# EAGLE design BottleBuddy-V1.1 (EAGLE 7.4.0)
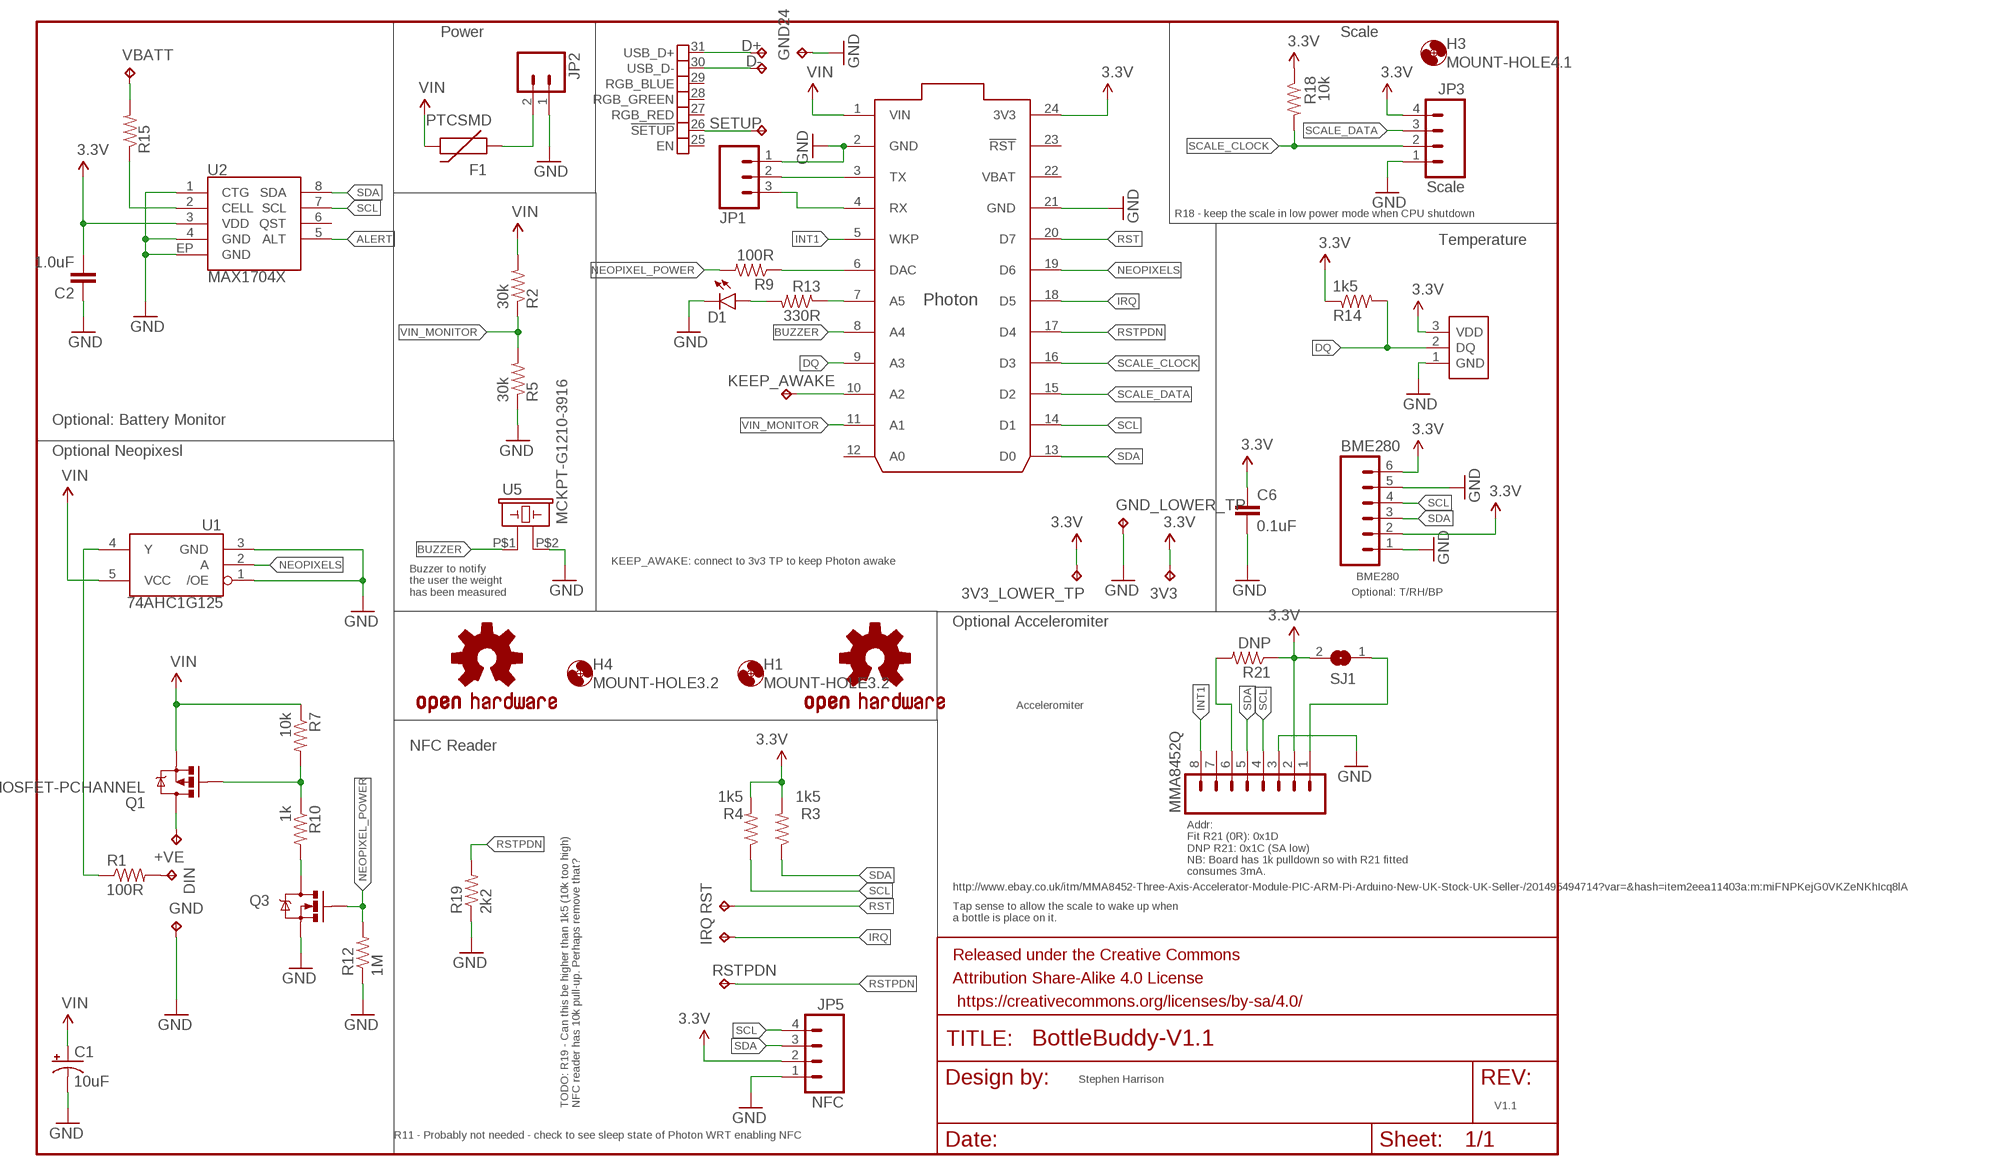
[diagram p0: schematic, sheet 1]

## Parts
3V3  TPTP20R  [TP20R]
3V3_LOWER_TP  TPTP20R  [TP20R]
+VE  TPTP20R  [TP20R]
BME280  M06SILK_FEMALE_PTH  [1X06]
C1  10uF  10UF-16V-10%(TANT)  [EIA3216]
C2  1.0uF  1.0UF-25V-+80/-20(0805)"  [0805-CAP]
C6  0.1uF  CAP0805  [0805]
D1  LED1206-BOTTOM  [LED-1206-BOTTOM]
D+  TPTP20R  [TP20R]
D-  TPTP20R  [TP20R]
DIN  TPTP20R  [TP20R]
F1  PTCSMD  [PTC-1206]
FRAME1  FRAME-LETTER  [CREATIVE_COMMONS]
GND  TPTP20R  [TP20R]
GND24  TPTP20R  [TP20R]
GND_LOWER_TP  TPTP20R  [TP20R]
H1  MOUNT-HOLE3.2  [3,2]
H3  MOUNT-HOLE4.1  [4,1]
H4  MOUNT-HOLE3.2  [3,2]
IRQ  NFC IRQ  TPTP20R  [TP20R]
JP1  M03PTH  [1X03]
JP2  M02-JST-2MM-SMT  [JST-2-SMD]
JP3  Scale  M04PTH  [1X04]
JP5  NFC  M04PTH  [1X04]
KEEP_AWAKE  TPTP20R  [TP20R]
LOGO1  OSHW-LOGOL  [OSHW-LOGO-L]
LOGO2  OSHW-LOGOL  [OSHW-LOGO-L]
MMA8452Q  M08SILK_FEMALE_PTH  [1X08]
Q1  MOSFET-PCHANNEL  [SOT23-3]
Q3  200mA/50V  MOSFET-NCHANNELBSS138  [SOT23-3]
R1  100R  RESISTOR1206  [1206]
R2  30k  RESISTOR1206  [1206]
R3  1k5  RESISTOR1206  [1206]
R4  1k5  RESISTOR1206  [1206]
R5  30k  RESISTOR1206  [1206]
R7  10k  RESISTOR1206  [1206]
R9  100R  RESISTOR1206  [1206]
R10  1k  RESISTOR1206  [1206]
R12  1M  RESISTOR1206  [1206]
R13  330R  RESISTOR1206  [1206]
R14  1k5  RESISTOR1206  [1206]
R15  RESISTOR1206  [1206]
R18  10k  RESISTOR1206  [1206]
R19  2k2  RESISTOR1206  [1206]
R21  DNP  RESISTOR1206  [1206]
RST  TPTP20R  [TP20R]
RSTPDN  NFC IRQ  TPTP20R  [TP20R]
S1  SENSOR-DS18B20  [TO-92-TRIANGLE]
SETUP  TPTP20R  [TP20R]
SJ1  SJ  [SJ]
U1  74AHC1G125  [SOT23-5]
U2  MAX1704X  [TDFN-8]
U5  MCKPT-G1210-3916  [BUZZER-12MM]
U$1  PHOTON_SMD  [PHOTON_SMD]
VBATT  TPTP20R  [TP20R]

## Nets
3.3V: 3V3.TP 3V3_LOWER_TP.TP BME280.2 BME280.6 C2.2 C6.1 JP3.4 JP5.2 MMA8452Q.2 R3.2 R4.2 R14.1 R18.1 R21.1 S1.3(VDD) SJ1.2 U2.3(VDD) U$1.24(3V3)
ALERT: U2.5(ALT)
BUZZER: U5.P$1 U$1.8(A4)
DQ: R14.2 S1.2(DQ) U$1.9(A3)
GND: BME280.1 BME280.5 C1.C(-) C2.1 C6.2 D1.C GND24.TP GND.TP GND_LOWER_TP.TP JP1.1 JP2.1 JP3.1 JP5.1 MMA8452Q.3 Q3.2(S) R5.1 R12.1 R19.1 S1.1(GND) U1.1(/OE) U1.3(GND) U2.1(CTG) U2.4(GND) U2.EP(GND) U5.P$2 U$1.2(GND) U$1.21(GND)
INT1: MMA8452Q.8 U$1.5(WKP)
IRQ: IRQ.TP U$1.18(D5)
N$1: Q1.1(G) R7.2 R10.1
N$2: F1.1 JP2.2
N$3: Q3.3(D) R10.2
N$4: JP1.3 U$1.4(RX)
N$5: R9.1 U$1.6(DAC)
N$6: +VE.TP Q1.3(D)
N$7: JP1.2 U$1.3(TX)
N$9: D1.A R13.2
N$10: R13.1 U$1.7(A5)
N$11: R15.2 VBATT.TP
N$12: KEEP_AWAKE.TP U$1.10(A2)
N$14: DIN.TP R1.2
N$15: R15.1 U2.2(CELL)
N$16: R1.1 U1.4(Y)
N$17: D+.TP U$1.31(USB_D+)
N$18: MMA8452Q.1 SJ1.1
N$19: D-.TP U$1.30(USB_D-)
N$20: MMA8452Q.6 R21.2
NEOPIXEL_POWER: Q3.1(G) R9.2 R12.2
NEOPIXELS: U1.2(A) U$1.19(D6)
RST: RST.TP U$1.20(D7)
RSTPDN: R19.2 RSTPDN.TP U$1.17(D4)
SCALE_CLOCK: JP3.2 R18.2 U$1.16(D3)
SCALE_DATA: JP3.3 U$1.15(D2)
SCL: BME280.4 JP5.4 MMA8452Q.4 R4.1 U2.7(SCL) U$1.14(D1)
SDA: BME280.3 JP5.3 MMA8452Q.5 R3.1 U2.8(SDA) U$1.13(D0)
SETUP: SETUP.TP U$1.26(!SETUP)
VIN: C1.A(+) F1.2 Q1.2(S) R2.2 R7.1 U1.5(VCC) U$1.1(VIN)
VIN_MONITOR: R2.1 R5.2 U$1.11(A1)
Unconnected: MMA8452Q.7 U2.6(QST) U$1.12(A0) U$1.23(!RST) U$1.25(EN) U$1.27(RGB_RED) U$1.28(RGB_GREEN) U$1.29(RGB_BLUE)

## Notes on the sheet
- Power | Scale
- R18 - keep the scale in low power mode when CPU shutdown
- Temperature
- Optional: Battery Monitor
- Optional Neopixesl
- KEEP_AWAKE: connect to 3v3 TP to keep Photon awake
- BME280
- Buzzer to notify
  the user the weight
  has been measured
- Optional: T/RH/BP
- Optional Acceleromiter
- Acceleromiter
- NFC Reader
- Addr: 
  Fit R21 (0R): 0x1D
  DNP R21: 0x1C (SA low)
  NB: Board has 1k pulldown so with R21 fitted
  consumes 3mA.
- http://www.ebay.co.uk/itm/MMA8452-Three-Axis-Accelerator-Module-PIC-ARM-Pi-Arduino-New-UK-Stock-UK-Seller-/201495494714?var=&hash=item2eea11403a:m:miFNPKejG0VKZeNKhIcq8lA
- Tap sense to allow the scale to wake up when
  a bottle is place on it.
- Stephen Harrison
- TODO: R19 - Can this be higher than 1k5 (10k too high)
  NFC reader has 10k pull-up. Perhaps remove that?
- V1.1
- R11 - Probably not needed - check to see sleep state of Photon WRT enabling NFC

## Power pins joined to a net without a drawn wire
VBAT: U$1.22(VBAT)

## Library data of the parts
3V3 3V3_LOWER_TP +VE D+ D- DIN GND GND24 GND_LOWER_TP IRQ KEEP_AWAKE RST RSTPDN SETUP VBATT = testpad:TP: Test pad
BME280 = SparkFun-Connectors:M06: Header 6 Standard 6-pin 0.1" header. Use with straight break away headers (SKU : PRT-00116), right angle break away headers (PRT-00553), swiss pins (PRT-00743), machine pins (PRT-00117), and female headers (PRT-00115). Molex polarized connector foot print use with SKU : PRT-08094 with associated crimp pins and housings. NOTES ON THE VARIANTS LOCK and LOCK_LONGPADS... This footprint was designed to help hold the alignment of a through-hole component (i.e. 6-pin header) while soldering it into place. You may notice that each hole has been shifted either up or down by 0.005 of an inch from it's more standard position (which is a perfectly straight line). This slight alteration caused the pins (the squares in the middle) to touch the edges of the holes. Because they are alternating, it causes a "brace" to hold the component in place. 0.005 has proven to be the perfect amount of "off-center" position when using our standard breakaway headers. Although looks a little odd when you look at the bare footprint, once you have a header in there, the alteration is very hard to notice. Also,if you push a header all the way into place, it is covered up entirely on the bottom side. This idea of altering the position of holes to aid alignment will be further integrated into the Sparkfun Library for other footprints. It can help hold any component with 3 or more connection pins.; PROD_ID: CONN-08437
C1 = SparkFun-Capacitors:10UF-16V-10%(TANT): CAP-00811 1206/EIA-3216 Tantalum capacitor; PROD_ID: CAP-00811
C2 = SparkFun-Capacitors:1.0UF-25V-+80/-20(0805): CAP-11625; PROD_ID: CAP-11625
C6 = SparkFun-Capacitors:CAP: Capacitor Standard 0603 ceramic capacitor, and 0.1" leaded capacitor.
D1 = SparkFun-LED:LED: LEDs Standard schematic elements and footprints for 5mm, 3mm, 1206, and 0603 sized LEDs. 5mm - Spark Fun Electronics SKU : COM-00529 (and others)
F1 = SparkFun-PowerIC:PTC: Resettable Fuse PTC Resettable Fuse. Spark Fun Electronics SKU : COM-08357; PROD_ID: RES-11150
FRAME1 = SparkFun-Aesthetics:FRAME-LETTER: Schematic Frame Standard 8.5x11 US Letter frame
H1 H3 H4 = holes:MOUNT-HOLE: MOUNTING HOLE with drill center marker
JP1 = SparkFun-Connectors:M03: Header 3 Standard 3-pin 0.1" header. Use with straight break away headers (SKU : PRT-00116), right angle break away headers (PRT-00553), swiss pins (PRT-00743), machine pins (PRT-00117), and female headers (PRT-00115). Molex polarized connector foot print use with SKU : PRT-08232 with associated crimp pins and housings.
JP2 = SparkFun-Connectors:M02: Standard 2-pin 0.1" header. Use with - straight break away headers ( PRT-00116) - right angle break away headers (PRT-00553) - swiss pins (PRT-00743) - machine pins (PRT-00117) - female headers (PRT-00115) Molex polarized connector foot print use with: PRT-08233 with associated crimp pins and housings. 2.54_SCREWTERM for use with PRT-10571. 3.5mm Screw Terminal footprints for PRT-08084 5mm Screw Terminal footprints for use with PRT-08432; PROD_ID: CONN-11443
JP3 JP5 = SparkFun-Connectors:M04: Header 4 Standard 4-pin 0.1" header. Use with straight break away headers (SKU : PRT-00116), right angle break away headers (PRT-00553), swiss pins (PRT-00743), machine pins (PRT-00117), and female headers (PRT-00115). Molex polarized connector foot print use with SKU : PRT-08231 with associated crimp pins and housings. 1MM SMD Version SKU: PRT-10208
LOGO1 LOGO2 = SparkFun-Aesthetics:OSHW-LOGO: Open Source Hardware Logo This logo indicates the piece of hardware it is found on incorporates a OSHW license and/or adheres to the definition of open source hardware found here: http://freedomdefined.org/OSHW
MMA8452Q = SparkFun-Connectors:M08: Header 8 Standard 8-pin 0.1" header. Use with straight break away headers (SKU : PRT-00116), right angle break away headers (PRT-00553), swiss pins (PRT-00743), machine pins (PRT-00117), and female headers (PRT-00115).; PROD_ID: CONN-08438
Q1 = SparkFun-DiscreteSemi:MOSFET-PCHANNEL: Generic PMOSFET IRLML2244 - TRANS-11153 (SOT-23 -20V -4.3A) (1.Gate 2.Source 3.Drain) FQP27P06 - COM-10349 <http://www.sparkfun.com/products/10349> (TO-220 -60V -27A) (1.Gate 2.Source 3.Drain); PROD_ID: TRANS-08285
Q3 = SparkFun-DiscreteSemi:MOSFET-NCHANNEL: Common NMOSFET Parts MFG P/N Store ID Prod ID FDD8780 TRANS-09984 SI7820DN TRANS-11055 FDS6630A IC-08089 2N7002PW TRANS-11151 FQP30N06L COM-10213 TRANS-10060 BSS123LT1G TRANS-08345 BSS138 TRANS-00830 BS170 2N7000; PROD_ID: TRANS-00830
R1-R5 R7 R9 R10 R12-R15 R18 R19 R21 = SparkFun-Resistors:RESISTOR: Resistor Basic schematic elements and footprints for 0603, 1206, and PTH resistors.
S1 = SENSOR-DS18B20:SENSOR-DS18B20
SJ1 = jumper:SJ: SMD solder JUMPER
U1 = SparkFun-DigitalIC:74AHC1G125: Single bus buffer gate with 3-state output; PROD_ID: IC-11920
U2 = SparkFun-PowerIC:MAX1704X: MAX17043/MAX17044: Battery Fuel Guage (43 is 1cell, 44 is 2cell); PROD-ID: IC-10399
U5 = Tinamous:MCKPT-G1210-3916
U$1 = Tinamous:PHOTON_SMD: Photon (without headers) - designed to be surface mounted with 7 extra exposed pads on the bottom of the board which include, 3 RGB LED outputs, /SETUP, EN (3.3V SMPS enable input), USB D+ and USB D-.

## Board
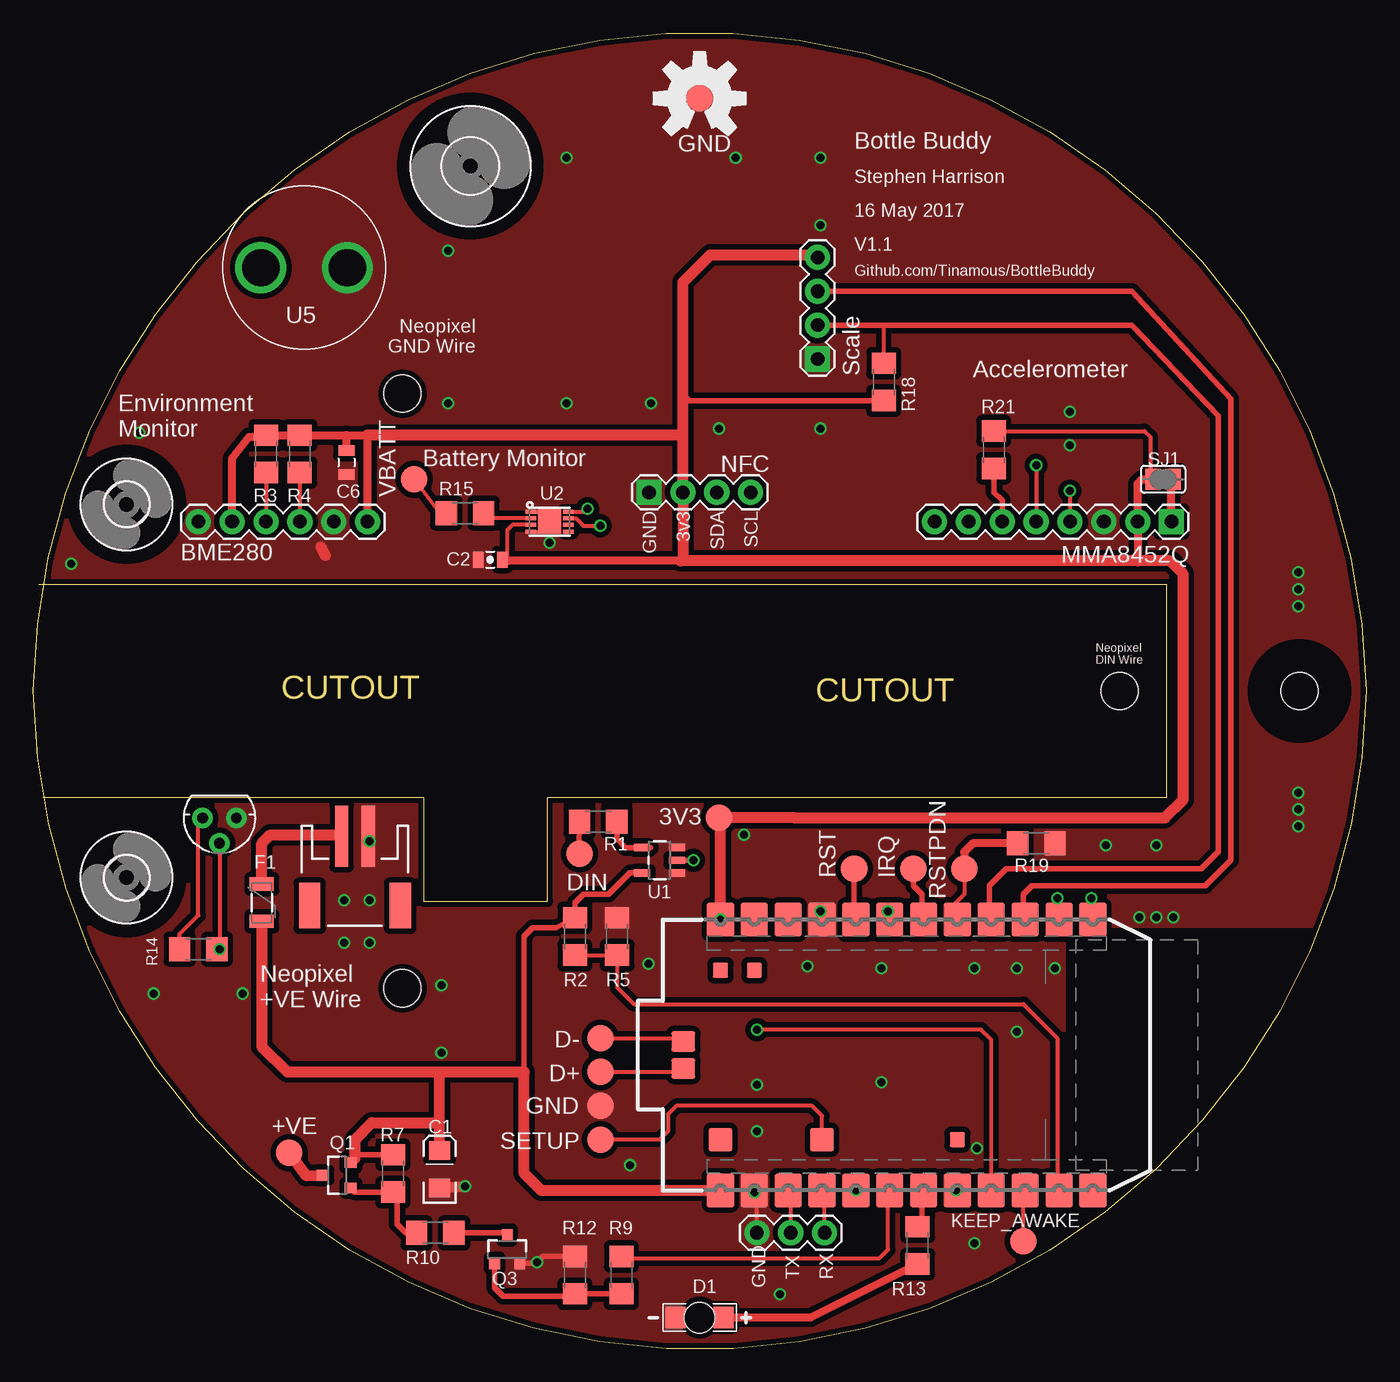
[diagram p1: board, top side]
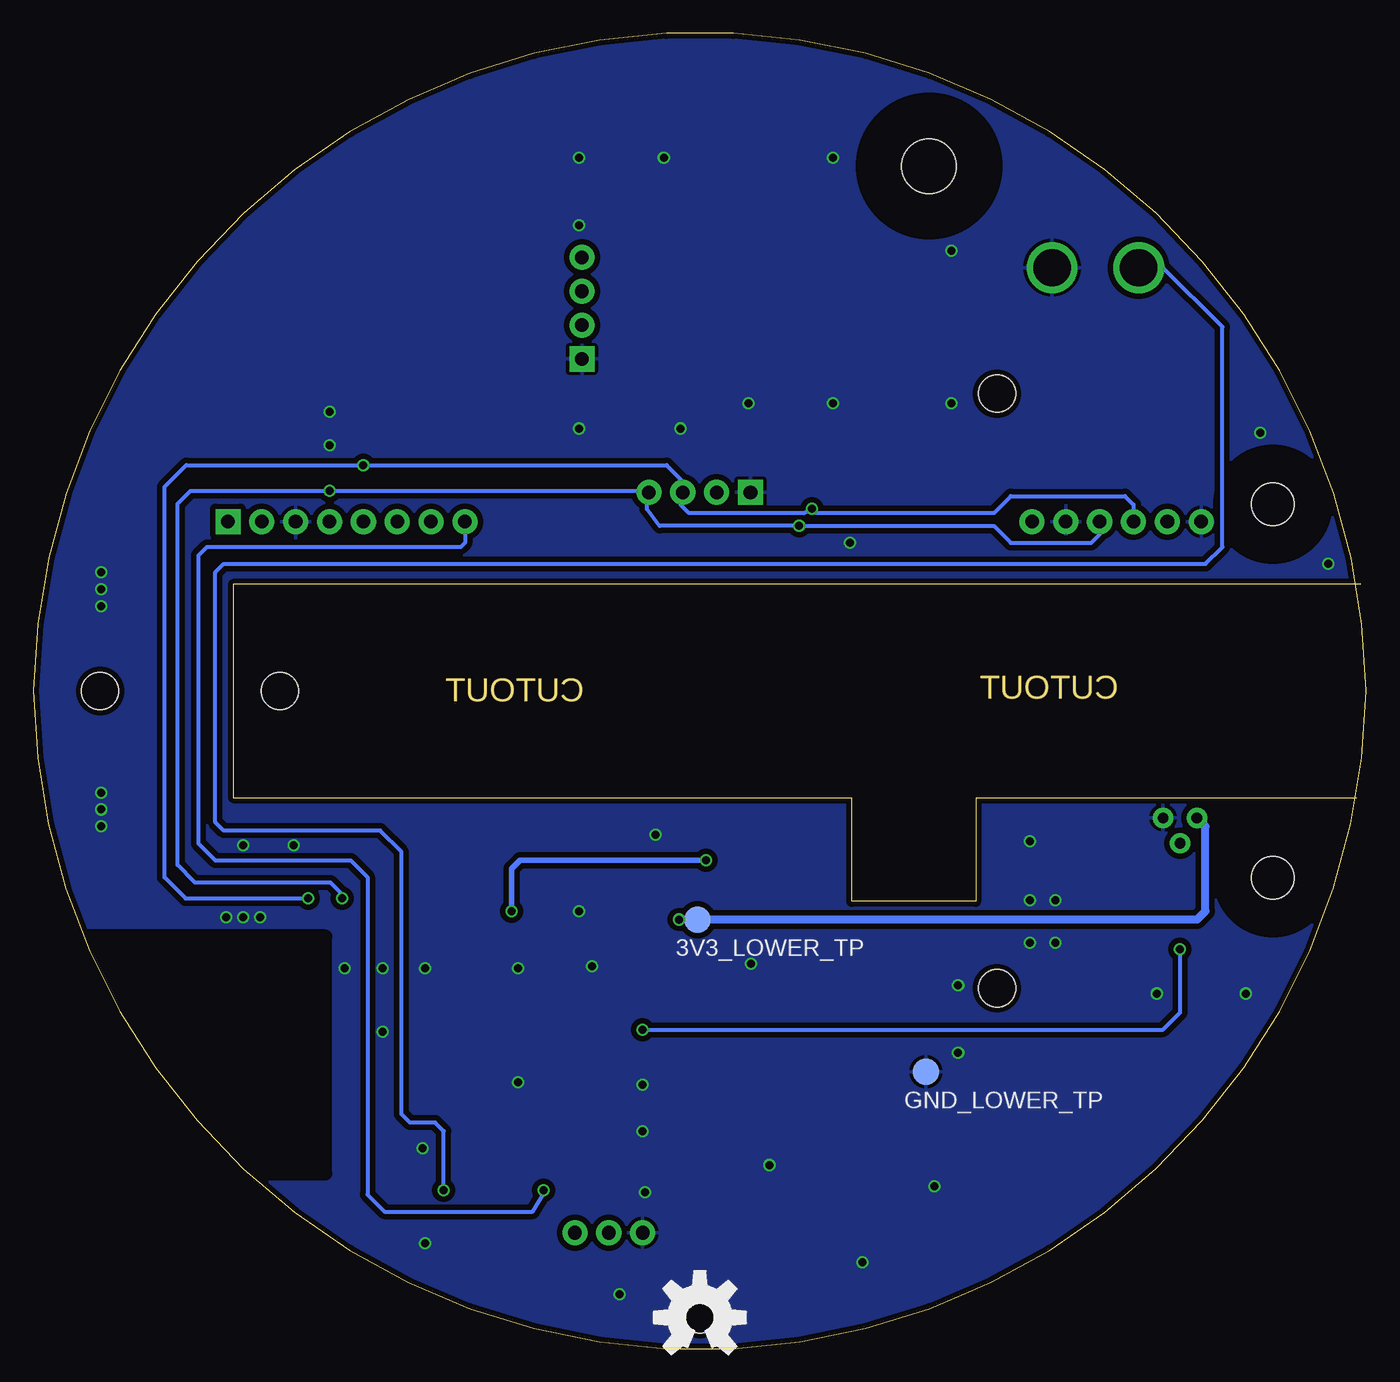
[diagram p2: board, bottom side, seen from below]

Size 100.01 x 98.66 mm. Coordinates in mm from the lower left corner, seen from the top.
Outline: 100,49.33 arc179 0,49.33 0.01,49.33 arc179 100.01,49.33
Outline: 0.4,57.33 85,57.33 85,41.33 38.6,41.33 38.6,33.55 29.3,33.55 29.3,41.33 0.7,41.33
Copper layers (1*16): Top 0.035mm / dielectric 1.5mm / Bottom 0.035mm
Design rules "dirt_cheap_dirty_boards.v1": minimum track width 5mil, minimum drill 12mil, track to track 5mil, track to pad 5mil, pad to pad 5mil, via to via 5mil, smd to smd 0mil, copper to edge 10mil, drill to drill 10mil, minimum pad ring 10mil, minimum via ring 6mil, stop-mask expansion 2mil, vias tented up to drill 25mil, thermal gap 10mil
Holes 2.8 mm at 81.5,49.33 27.7,71.63 27.7,27.03 95,49.33
tRestrict: area 78.1,13.1 to 98.4,30.9; area 91.8,46.2 to 98.2,52.5
bRestrict: area 78.1,13.1 to 98.4,30.9

### Footprints (pad centres in the part's own frame; a part is rotated, then mirrored left to right if it is on the bottom)
TP20R = smd 2 x 2: TP 0,0
1X06 = drill 1.016 pad 1.88: 1 0,0; 2 2.54,0; 3 5.08,0; 4 7.62,0; 5 10.16,0; 6 12.7,0
EIA3216 = smd 1.4 x 1.6: A 1.4,0; C -1.4,0
0805-CAP = smd 0.8 x 1.2: 1 -0.9,0; 2 0.9,0
0805 = smd 0.8 x 1.2: 1 -0.9,0; 2 0.9,0
LED-1206-BOTTOM = smd 1.5 x 1.6: A -1.8,0; C 1.8,0 | hole 2.3: 0,0
PTC-1206 = smd 1 x 1.8: 1 -1.4,0; 2 1.4,0
3,2 = hole 3.2: 0,0
4,1 = hole 4.1: 0,0
1X03 = drill 1.016 pad 1.88: 1 0,0; 2 2.54,0; 3 5.08,0
JST-2-SMD = smd 1 x 4.6: 1 -1,-3.7; 2 1,-3.7 | smd 1.6 x 3.4: NC1 -3.4,1.5; NC2 3.4,1.5
1X04 = drill 1.016 pad 1.88 square: 1 0,0 | drill 1.016 pad 1.88: 2 2.54,0; 3 5.08,0; 4 7.62,0
1X08 = drill 1.016 pad 1.88 square: 1 0,0 | drill 1.016 pad 1.88: 2 2.54,0; 3 5.08,0; 4 7.62,0; 5 10.16,0; 6 12.7,0; 7 15.24,0; 8 17.78,0
SOT23-3 = smd 0.8 x 0.9: 1 -0.95,-1; 2 0.95,-1; 3 0,1.1
1206 = smd 1.6 x 1.8: 1 -1.4,0; 2 1.4,0
TO-92-TRIANGLE = drill 0.813 pad 1.524: 1 -1.27,0; 2 0,1.905; 3 1.27,0
SJ = smd 1.168 x 1.6: 1 -0.762,0; 2 0.762,0
SOT23-5 = smd 0.55 x 1.2: 1 -0.95,-1.3; 2 0,-1.3; 3 0.95,-1.3; 4 0.95,1.3; 5 -0.95,1.3
TDFN-8 = smd 0.8 x 0.3: 1 -1.4,0.75; 2 -1.4,0.25; 3 -1.4,-0.25; 4 -1.4,-0.75; 5 1.4,-0.75; 6 1.4,-0.25; 7 1.4,0.25; 8 1.4,0.75 | smd 1.73 x 1.88: EP 0,0
BUZZER-12MM = drill 2.8: P$1 -3.25,0; P$2 3.25,0
PHOTON_SMD = smd 2.54 x 2.032: 1 0,32.258; 2 0,29.718; 3 0,27.178; 4 0,24.638; 5 0,22.098; 6 0,19.558; 7 0,17.018; 8 0,14.478; 9 0,11.938; 10 0,9.398; 11 0,6.858; 12 0,4.318; 13 20.32,4.318; 14 20.32,6.858; 15 20.32,9.398; 16 20.32,11.938; 17 20.32,14.478; 18 20.32,17.018; 19 20.32,19.558; 20 20.32,22.098; 21 20.32,24.638; 22 20.32,27.178; 23 20.32,29.718; 24 20.32,32.258 | smd 1.778 x 1.778: 25 3.81,32.258; 26 3.81,24.638 | smd 1.143 x 1.143: 27 3.81,14.478; 28 16.51,29.718; 29 16.51,32.258 | smd 1.524 x 1.778: 30 11.176,35.052; 31 9.144,35.052

### Placement (x,y rotation side)
3V3  51.44,39.8 0 top
3V3_LOWER_TP  50.16,32.18 0 bottom
+VE  19.21,14.7 0 top
BME280  12.38,62.03 0 top
C1  30.48,13.45 90 top
C2  34.29,59.17 0 top
C6  23.5,66.47 270 top
D1  50,2.33 180 top
D+  42.55,20.75 0 top
D-  42.55,23.29 0 top
DIN  41,37.1 0 top
F1  17.14,33.45 270 top
FRAME1  18.7,-10.82 0 top  (outside the outline)
GND  50,93.78 0 top
GND24  42.55,18.21 0 top
GND_LOWER_TP  33.02,20.75 0 bottom
H1  7,35.33 0 top
H3  32.8,88.7 0 top
H4  7,63.33 0 top
IRQ  66.04,35.99 0 top
JP1  54.29,8.69 0 top
JP2  24.13,34.72 180 top
JP3  58.85,74.23 90 top
JP5  46.2,64.23 0 top
KEEP_AWAKE  74.3,8.05 0 top
LOGO1  50,2.33 0 bottom
LOGO2  50,93.78 0 top
MMA8452Q  85.41,62.03 180 top
Q1  22.82,13 90 top
Q3  35.56,7.42 0 top
R1  42.38,39.52 180 top
R2  40.64,30.91 90 top
R3  17.46,67.11 90 top
R4  20,67.11 90 top
R5  43.81,30.91 270 top
R7  26.99,13.13 270 top
R9  44.13,5.51 270 top
R10  30.16,8.69 0 top
R12  40.64,5.51 270 top
R13  66.36,7.74 270 top
R14  12.38,29.96 0 top
R15  32.38,62.66 180 top
R18  63.82,72.51 90 top
R19  75.25,37.9 180 top
R21  72.07,67.43 270 top
RST  61.59,35.99 0 top
RSTPDN  69.85,35.99 0 top
S1  13.97,39.8 180 top
SETUP  42.55,15.67 0 top
SJ1  84.77,65.2 180 top
U1  46.99,36.63 90 top
U2  38.73,62.03 0 top
U5  20.32,81.08 0 top
U$1  83.82,11.86 90 top
VBATT  28.57,65.2 0 top

### Tracks (layer width: path | path; a pad name or v marks a point on that pad's centre or on a via)
3.3V  (via drill 0.6)
  Top 0.305: U2.3 35.95,61.78 35.56,61.39 35.56,59.49 34.92,59.17 C2.2 | 51.44,38.21 3V3.TP | R21.1 83.37,68.82 83.82,68.38 83.82,65.39 SJ1.2 | R14.1 10.98,31.1 12.38,32.5 12.38,39.49 S1.3
  Top 0.406: R18.1 49.19,71.1 48.74,71.55
  Top 0.61: 23.5,68.51 R4.2 R3.2 17.02,68.38 16.19,68.38 14.92,66.79 BME280.2 | 23.5,68.51 25.08,68.51 BME280.6 | 82.87,59.09 MMA8452Q.2 82.87,64.88 83.19,65.2 SJ1.2 | C6.1 23.5,68.51 | 48.74,59.24 48.58,59.09 35.59,59.09 C2.2 | 57.15,39.81
  Top 0.813: v51.56,32.18 51.56,39.93 3V3.TP 51.76,39.81 57.15,39.81 84.92,39.81 86.29,41.18 86.29,58.11 85.32,59.09 82.87,59.09 48.58,59.09 | 48.74,59.24 JP5.2 48.74,68.38 | 48.74,68.38 48.74,71.55 48.74,79.97 50.8,82.03 58.57,82.03 JP3.4 | 48.74,68.38 48.61,68.51 25.08,68.51
  Bottom 0.61: v51.56,32.18 3V3_LOWER_TP.TP 12.7,32.18 12.06,32.82 12.06,39.17 S1.3
BUZZER  (via drill 0.6)
  Top 0.305: U$1.8 v69.22,11.86
  Bottom 0.305: U5.P$1 15.24,81.08 10.79,76.63 10.79,60.12 12.06,58.85 85.72,58.85 86.36,58.22 86.36,39.49 85.72,38.85 73.98,38.85 72.39,37.26 72.39,17.58 71.75,16.94 69.85,16.94 69.22,16.31 v69.22,11.86
DQ  (via drill 0.6)
  Top 0.305: U$1.9 71.88,23.17 71.12,23.93 v54.29,23.93 | S1.2 13.97,30.15 R14.2 13.78,30.15 v13.97,29.96
  Bottom 0.305: v54.29,23.93 15.24,23.93 13.97,25.2 v13.97,29.96
GND  (via drill 0.6)
  Top 0.305: U2.4 37.98,61.28 U2.EP 37.98,62.78 U2.1 | JP1.1 54.29,11.55 53.98,11.86
  Top 0.406: 54.74,12.49 U$1.2 54.11,11.85 v54.11,11.71 | Q3.2 37.51,6.42 v37.78,6.47 38.23,6.91 R12.1 | 59.19,32.19 U$1.21 | R5.1 43.63,32.95
  Top 0.813: 21.59,60.12 21.91,59.49 | C1.C v32.38,12.18
  other vias: 59.05,32.82 94.93,56.95 94.93,40.44 25.22,38.06 46.17,28.86 77.79,67.74 38.73,60.44 70.62,7.9 80.46,37.75 77.79,70.28 94.93,58.22 94.93,55.68 94.93,41.71 94.93,39.17 44.77,13.77 54.29,16.31 54.29,19.8 58.1,28.69 84.27,37.75 73.8,28.54 2.86,58.85 7.94,68.7 56.02,4.09 70.8,15.04 30.62,27.27 30.62,22.19 15.69,26.63 9.03,26.63 51.44,69.01 46.35,70.92 40.01,89.33 40.01,70.92 31.11,70.92 31.11,82.35 52.7,89.33 59.05,89.33 59.05,84.25 59.05,69.01 25.22,33.62 25.22,30.44 23.31,30.44 23.31,33.62 76.65,28.54 83,32.35 84.27,32.35 85.54,32.35 53.34,38.53 70.62,28.54 63.64,28.54 63.64,19.97 73.8,23.78
  pour Bottom (isolate 0.406, rank 5): -1,48.53 -0.9,70.53 26.3,97.63 36.8,97.63 39.8,100.63 62.1,100.63 66.2,96.53 74.3,96.53 101.4,69.43 100.6,29.63 73.9,-1.97 28.5,-0.87 4.4,17.23
  pour Top (isolate 0.406, no thermals): -1.27,109.02 105.41,109.02 110.49,103.94 110.49,8.05 95.25,-7.19 13.97,-7.19 -15.88,22.66 -15.88,94.41
INT1  (via drill 0.6)
  Top 0.305: U$1.5 61.72,11.35 61.59,11.23 61.59,11.74 U$1.5
  Bottom 0.305: MMA8452Q.8 67.63,60.44 67.94,60.12 87,60.12 87.63,59.49 87.63,37.9 86.36,36.63 76.2,36.63 74.93,35.36 74.93,11.55 73.66,10.27 62.55,10.27 61.59,11.86 61.59,11.99 U$1.5
  other vias: 61.72,11.86
IRQ
  Top 0.406: IRQ.TP 66.04,34.72 66.67,34.09 66.67,32.31 U$1.18
N$1
  Top 0.406: R10.1 27.94,8.69 27.3,9.32 27.3,11.41 R7.2 24.14,11.73 Q1.1
N$2
  Top 0.813: F1.1 16.96,34.85 17.14,34.72 17.14,37.9 17.78,38.53 23.02,38.53 JP2.2
N$3
  Top 0.406: R10.2 35.39,8.69 Q3.3
N$4
  Top 0.305: JP1.3 59.37,11.67 U$1.4
N$5
  Top 0.305: R9.1 44.13,7.1 44.45,6.78 63.5,6.78 64.14,7.42 64.14,11.74 U$1.6
N$6
  Top 0.813: +VE.TP 20.48,12.97 Q1.3
N$7
  Top 0.305: JP1.2 56.83,11.67 U$1.3
N$9
  Top 0.61: R13.2 58.33,2.33 D1.A
N$10
  Top 0.406: R13.1 66.36,9.32 66.67,9.32 66.67,11.74 U$1.7
N$11
  Top 0.305: VBATT.TP 30.48,62.66 R15.2
N$12
  Top 0.305: KEEP_AWAKE.TP 74.3,11.74 U$1.10
N$14
  Top 0.406: DIN.TP 41.16,36.94 40.95,37.58 R1.2
N$15
  Top 0.305: U2.2 34.03,62.28 R15.1
N$16
  Top 0.406: R1.1 43.78,38.25 44.45,37.58 46.32,37.58 U1.4
N$17
  Top 0.305: D+.TP 48.51,20.75 U$1.31
N$18
  Top 0.61: MMA8452Q.1 85.41,65.08 SJ1.1
N$19
  Top 0.305: D-.TP 48.51,23.29 U$1.30
N$20
  Top 0.406: R21.2 72.07,64.25 72.71,63.61 MMA8452Q.6
NEOPIXEL_POWER
  Top 0.406: Q3.1 34.61,4.88 34.61,4.56 35.24,3.92 40.45,3.92 R12.2 R9.2
NEOPIXELS  (via drill 0.6)
  Top 0.406: v64.14,32.82 64.14,32.31 U$1.19 | U1.2 v49.53,36.63
  Bottom 0.406: v49.53,36.63 63.5,36.63 64.14,35.99 v64.14,32.82
RST
  Top 0.406: RST.TP 61.59,32.31 U$1.20
RSTPDN
  Top 0.305: RSTPDN.TP 69.85,34.09 69.22,33.45 69.22,32.31 U$1.17
  Top 0.61: R19.2 70.48,37.9 69.85,37.26 RSTPDN.TP
SCALE_CLOCK
  Top 0.305: R18.2 63.82,76.77 62.87,76.77
  Top 0.406: JP3.2 62.87,76.77 82.41,76.77 88.9,69.96 88.9,37.26 87.63,35.99 73.03,35.99 71.75,34.72 71.75,32.31 U$1.16
SCALE_DATA
  Top 0.406: JP3.3 82.41,79.31 89.85,71.23 89.85,36.63 87.95,34.72 74.93,34.72 74.3,34.09 74.3,32.31 U$1.15
SCL  (via drill 0.6)
  Top 0.305: U2.7 40.71,62.28 41.27,61.71 v42.55,61.71 | v77.79,64.33 MMA8452Q.4 | R4.1 BME280.4
  Top 0.406: v76.83,33.77 76.83,32.31 U$1.14
  Bottom 0.305: v76.83,33.77 76.83,34.09 77.72,34.98 87.89,34.98 89.19,36.28 89.19,63.35 88.21,64.33 v77.79,64.33 53.77,64.33 53.77,64.28 JP5.4 53.98,64.07 53.98,62.98 53.02,61.71 v42.55,61.71 27.94,61.71 26.67,60.44 20.64,60.44 20,61.08 BME280.4
SDA  (via drill 0.6)
  Top 0.305: U2.8 41.39,62.78 v41.59,62.98 | v75.25,66.26 MMA8452Q.5 | R3.1 BME280.3
  Top 0.406: v79.38,33.77 79.38,32.31 U$1.13
  Bottom 0.305: v79.38,33.77 88.58,33.77 90.17,35.35 90.17,64.64 88.54,66.26 v75.25,66.26 52.5,66.26 51.44,65.2 51.44,64.38 JP5.3 51.44,64.07 51.44,63.3 50.8,62.66 42.23,62.66 v41.59,62.98 41.27,62.66 27.94,62.66 26.67,63.93 18.1,63.93 17.46,63.3 BME280.3
SETUP
  Top 0.305: U$1.26 59.18,17.45 58.42,18.21 48.26,18.21 47.62,17.58 47.62,16.31 46.99,15.67 SETUP.TP
VIN
  Top 0.406: R7.1 24.4,14.53 24.13,14.26 | U1.5 44.77,35.68 43.18,34.09 41.27,34.09 40.64,33.45 R2.2 39.24,31.55 37.47,31.55 36.83,30.91 36.83,20.75
  Top 0.813: 50.93,11.23 U$1.1 38.1,11.86 36.83,13.13 36.83,20.75 30.48,20.75 | Q1.2 24.13,14.26 24.13,15.67 25.4,16.94 30.48,16.94 | 30.48,15.04 C1.A 30.48,16.94 | F1.2 17.14,22.66 19.05,20.75 30.48,20.75 | 30.48,16.94 30.48,20.75
VIN_MONITOR
  Top 0.305: 76.83,11.99 76.83,23.29 74.3,25.83 45.09,25.83 43.81,27.1 R5.2 R2.1
  Top 0.406: 76.83,11.99 U$1.11

### Text on the board
Dimension: CUTOUT | CUTOUT
tPlace: Neopixel / DIN Wire
tNames: Bottle Buddy | Stephen Harrison | 16 May 2017 | V1.1 | Github.com/Tinamous/BottleBuddy | Neopixel / GND Wire | Accelerometer | Environment / Monitor | Battery Monitor | SCL | GND | 3v3 | SDA | Neopixel / +VE Wire | GND | TX | RX | GND